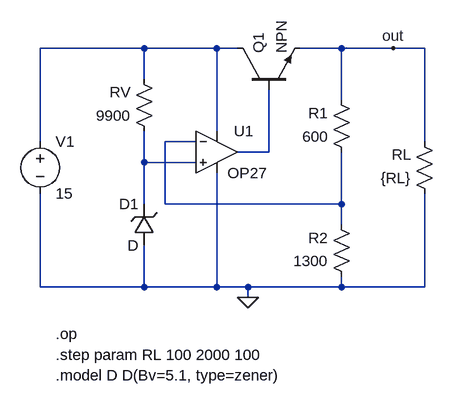
[diagram p0: schematic 02 Spannungs-Stabilisierung_OPV.asc]
02 Spannungs-Stabilisierung_OPV.asc, the LTspice schematic file:
Version 4
SHEET 1 968 680
WIRE 224 -128 64 -128
WIRE 336 -128 224 -128
WIRE 368 -128 336 -128
WIRE 528 -128 464 -128
WIRE 608 -128 528 -128
WIRE 656 -128 608 -128
WIRE 224 -80 224 -128
WIRE 528 -48 528 -128
WIRE 336 0 336 -128
WIRE 64 16 64 -128
WIRE 304 16 256 16
WIRE 656 16 656 -128
WIRE 416 32 416 -64
WIRE 416 32 368 32
WIRE 224 48 224 0
WIRE 304 48 224 48
WIRE 224 112 224 48
WIRE 256 112 256 16
WIRE 528 112 528 32
WIRE 528 112 256 112
WIRE 528 144 528 112
WIRE 64 240 64 96
WIRE 224 240 224 176
WIRE 224 240 64 240
WIRE 336 240 336 64
WIRE 336 240 224 240
WIRE 384 240 336 240
WIRE 528 240 528 224
WIRE 528 240 384 240
WIRE 656 240 656 96
WIRE 656 240 528 240
WIRE 384 256 384 240
FLAG 384 256 0
FLAG 608 -128 out
SYMBOL voltage 64 0 R0
WINDOW 123 0 0 Left 0
WINDOW 39 0 0 Left 0
SYMATTR InstName V1
SYMATTR Value 15
SYMBOL res 240 16 R180
WINDOW 0 36 76 Left 2
WINDOW 3 36 40 Left 2
SYMATTR InstName RV
SYMATTR Value 9900
SYMBOL res 544 48 R180
WINDOW 0 36 76 Left 2
WINDOW 3 36 40 Left 2
SYMATTR InstName R1
SYMATTR Value 600
SYMBOL res 544 240 R180
WINDOW 0 36 76 Left 2
WINDOW 3 36 40 Left 2
SYMATTR InstName R2
SYMATTR Value 1300
SYMBOL res 672 112 R180
WINDOW 0 36 76 Left 2
WINDOW 3 36 40 Left 2
SYMATTR InstName RL
SYMATTR Value {RL}
SYMBOL OpAmps\\OP27 336 -32 R0
WINDOW 0 26 32 Left 2
SYMATTR InstName U1
SYMBOL zener 240 176 R180
WINDOW 0 24 64 Left 2
WINDOW 3 24 0 Left 2
SYMATTR InstName D1
SYMBOL npn 368 -64 R270
SYMATTR InstName Q1
TEXT 88 344 Left 2 !.step param RL 100 2000 100
TEXT 88 312 Left 2 !.op
TEXT 88 376 Left 2 !.model D D(Bv=5.1, type=zener)

The netlist it stands for:
* 02 Spannungs-Stabilisierung_OPV.asc
V1 N001 0 15
RV N004 N001 9900
R1 N002 out 600
R2 0 N002 1300
RL 0 out {RL}
XU1 N004 N002 N001 0 N003 OP27  ; pins In+ In- V+ V- OUT
D1 0 N004 D
Q1 N001 N003 out 0 NPN
.model D D
.lib standard.dio
.model NPN NPN
.model PNP PNP
.lib standard.bjt
.step param RL 100 2000 100
.op
.model D D(Bv=5.1, type=zener)
.lib ADI.lib
.backanno
.end